# EAGLE design diffamp (EAGLE 9.4.2)
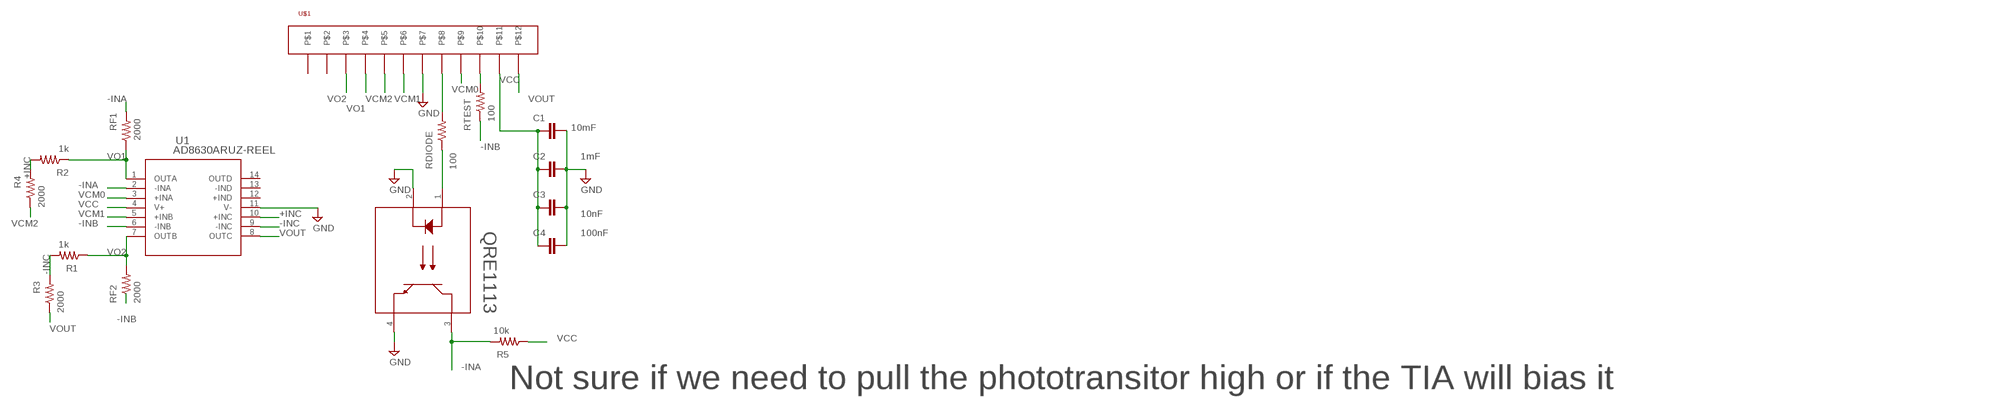
[diagram p0: schematic, sheet 1]

## Parts
C1  10mF  CAP0402-CAP  [0402-CAP]
C2  1mF  CAP0402-CAP  [0402-CAP]
C3  10nF  CAP0402-CAP  [0402-CAP]
C4  100nF  CAP0402-CAP  [0402-CAP]
Q1  QRE1113  [DIP4_100AQ_ONS]
R1  1k  R-US_R0603  [R0603]
R2  1k  R-US_R0603  [R0603]
R3  2000  R-US_R0603  [R0603]
R4  2000  R-US_R0603  [R0603]
R5  10k  R-US_R0603  [R0603]
RDIODE  100  R-US_R0603  [R0603]
RF1  2000  R-US_R0603  [R0603]
RF2  2000  R-US_R0603  [R0603]
RTEST  100  R-US_R0603  [R0603]
U1  AD8630ARUZ-REEL  [RU_14_ADI]
U$1  12PIN  [12PIN]

## Nets
+INC: R2.2 R4.2 U1.10(+INC)
-INA: Q1.3 R5.2 RF1.2 U1.2(-INA)
-INB: RF2.1 RTEST.1 U1.6(-INB)
-INC: R1.2 R3.2 U1.9(-INC)
GND: C1.2 C2.2 C3.2 C4.2 Q1.2 Q1.4 U1.11(V-) U$1.P$7
N$1: RDIODE.2 U$1.P$8
N$3: Q1.1 RDIODE.1
N$4: RTEST.2 U$1.P$10
VCC: C1.1 C2.1 C3.1 C4.1 R5.1 U1.4(V+) U$1.P$11
VCM0: U1.3(+INA) U$1.P$9
VCM1: U1.5(+INB) U$1.P$6
VCM2: R4.1 U$1.P$5
VO1: R2.1 RF1.1 U1.1(OUTA) U$1.P$4
VO2: R1.1 RF2.2 U1.7(OUTB) U$1.P$3
VOUT: R3.1 U1.8(OUTC) U$1.P$12
Unconnected: U1.12(+IND) U1.13(-IND) U1.14(OUTD) U$1.P$1 U$1.P$2

## Notes on the sheet
- Not sure if we need to pull the phototransitor high or if the TIA will bias it

## Library data of the parts
C1-C4 = pie:CAP: Capacitor Standard 0603 ceramic capacitor, and 0.1" leaded capacitor.; PIE-INT-REF-NUM: CAPACITOR-GENERIC
Q1 = pie:QRE1113; BUILT_BY: EMA_Cory; COPYRIGHT: Copyright (C) 2018 Accelerated Designs. All rights reserved; DATASHEET: https://www.onsemi.com/pub/Collateral/QRE1113-D.PDF; MANUFACTURER_PART_NUMBER: QRE1113; SOURCELIBRARY: ON_Semiconudctor_2020-04-15; VENDOR: ON Semiconductor
R1-R5 RDIODE RF1 RF2 RTEST = pie:R-US_: RESISTOR, American symbol; DESCRIPTION: RESISTOR, American symbol; DISTRIBUTOR: DigiKey; MANUFACTURER: Rohm Semiconductor; NOTES: Cut Tape; PACKAGE: R0603; VALUE: >VALUE
U1 = pie:AD8630ARUZ-REEL; BUILT_BY: EMA_Christopher; COPYRIGHT: Copyright (C) 2016 Accelerated Designs. All rights reserved; MANUFACTURER_PART_NUMBER: AD8630ARUZ-REEL; SOURCELIBRARY: Analog_Devices_2018-07-13; VENDOR: Analog Devices Inc
U$1 = pie:12PIN

## Board
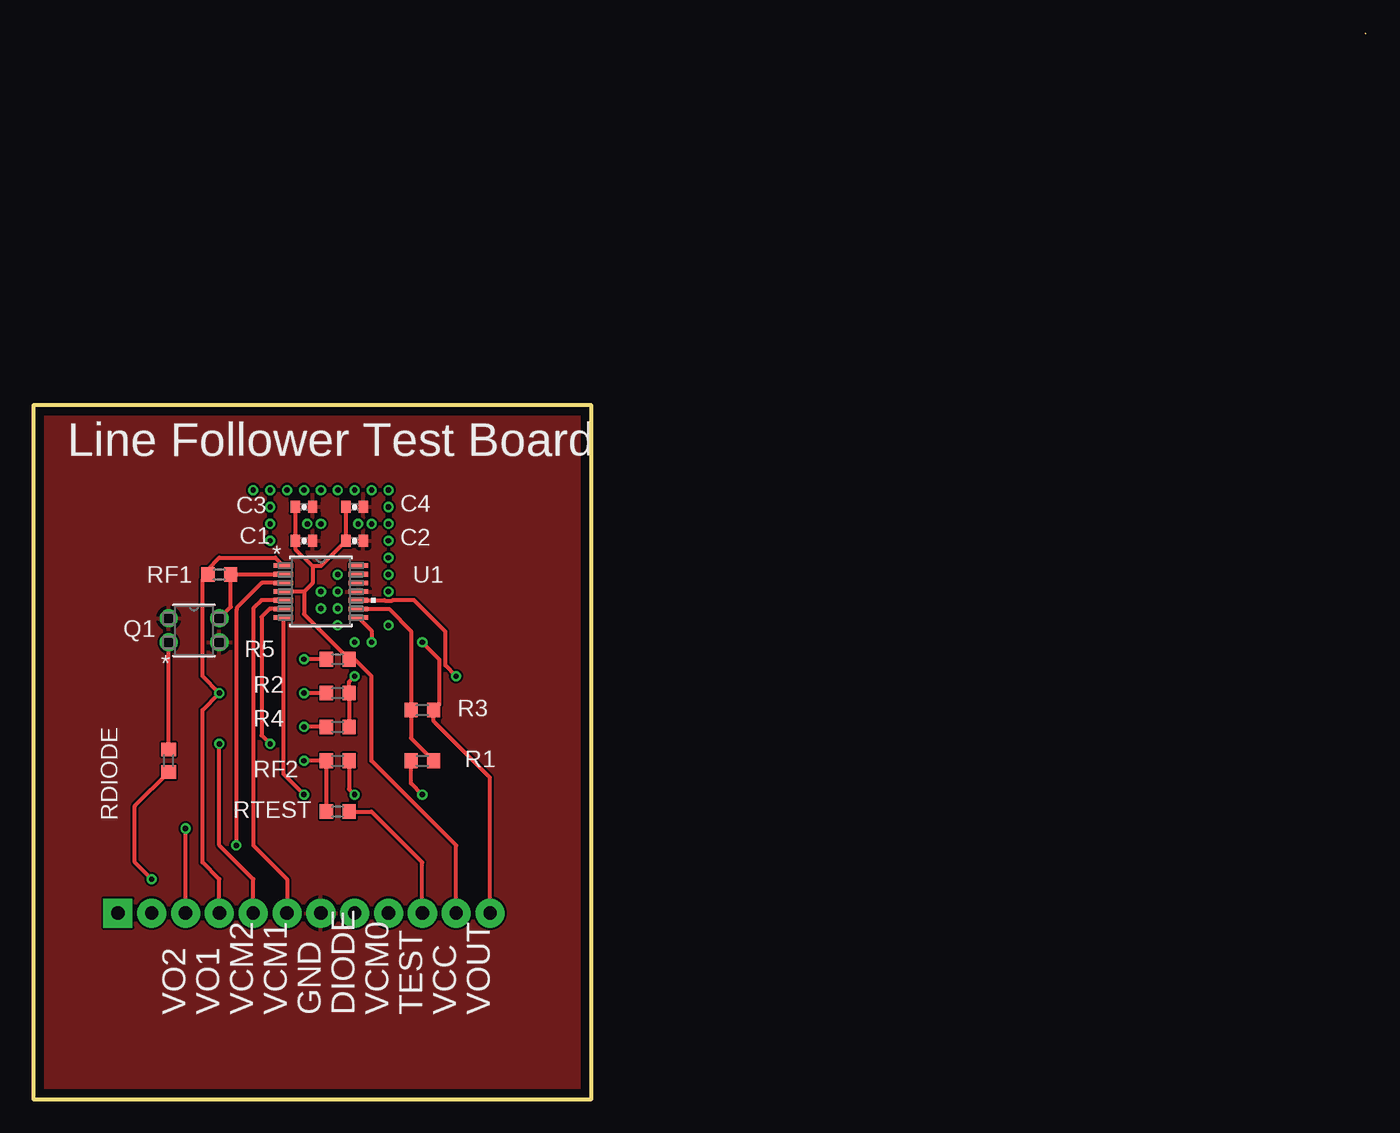
[diagram p1: board, top side]
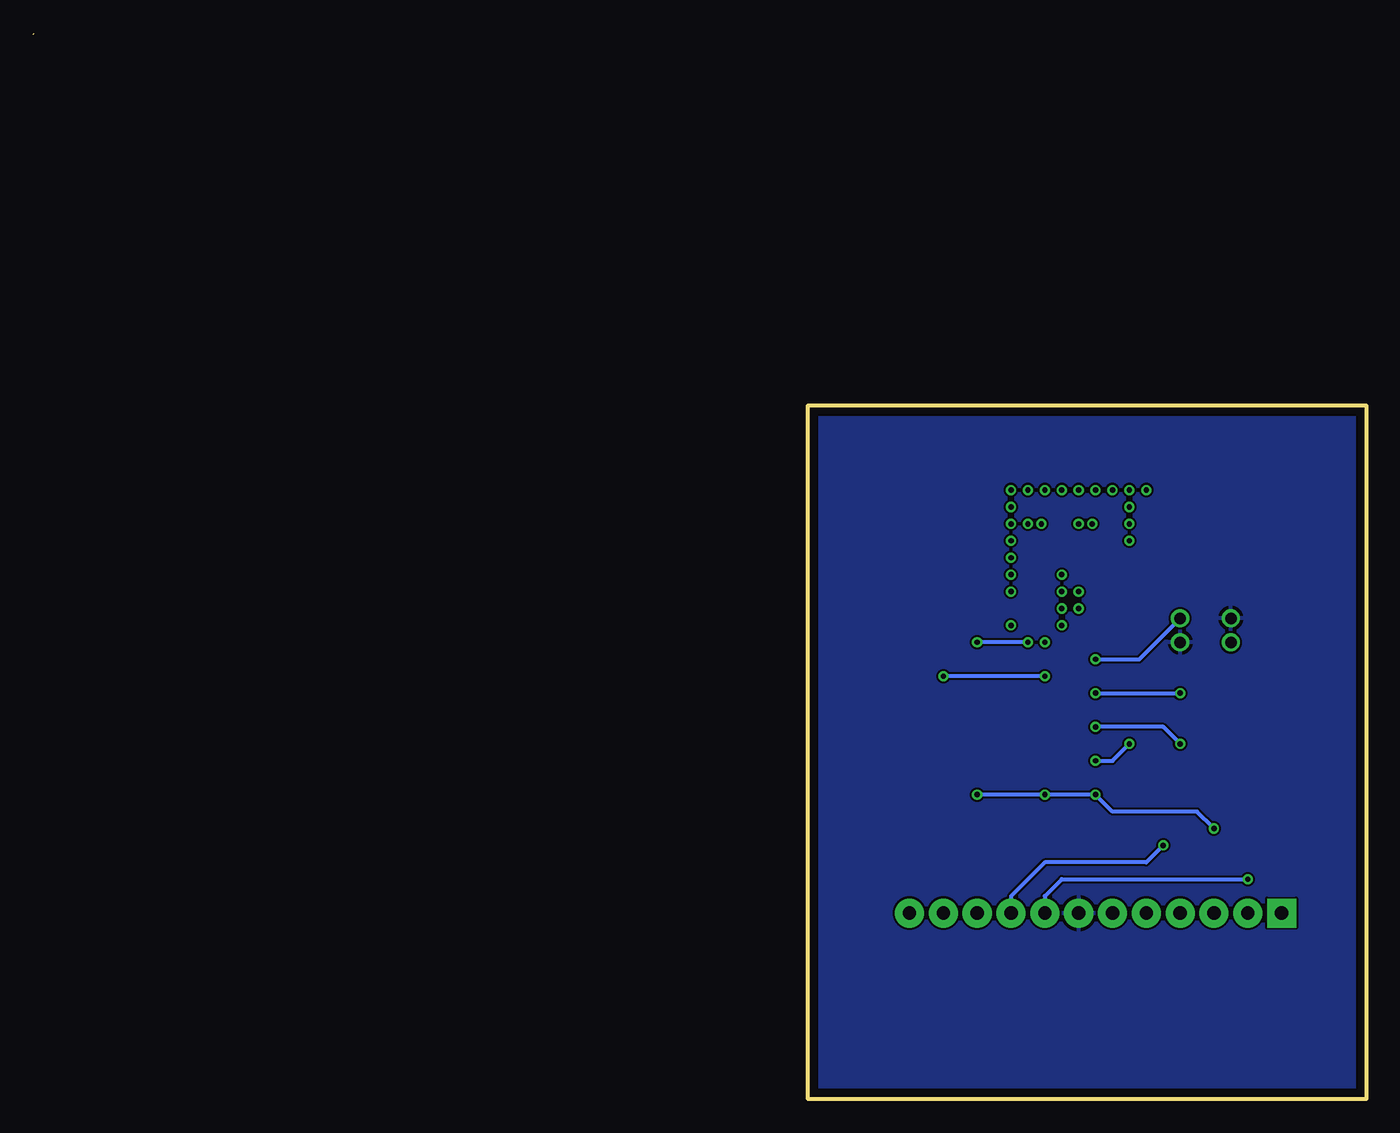
[diagram p2: board, bottom side, seen from below]

Size 100.08 x 80 mm. Coordinates in mm from the lower left corner, seen from the top.
Outline: 100.08,79.92 100,80
Outline: 0,0 41.91,0 41.91,52.07 0,52.07 0,0
Copper layers (1*16): Top 2mil / dielectric 9mil / Bottom 2mil
Design rules "pie": minimum track width 6mil, minimum drill 15mil, track to track 6mil, track to pad 6mil, pad to pad 6mil, via to via 6mil, smd to smd 6mil, copper to edge 25mil, drill to drill 7mil, minimum pad ring 7mil, minimum via ring 7mil, stop-mask expansion 3mil, vias tented up to drill 21mil, thermal gap 10mil

### Footprints (pad centres in the part's own frame; a part is rotated, then mirrored left to right if it is on the bottom)
0402-CAP = smd 0.7 x 0.9: 1 -0.65,0; 2 0.65,0
DIP4_100AQ_ONS = drill 0.864 pad 1.372: 1 0,0; 2 3.81,0; 3 3.81,1.803; 4 0,1.803
R0603 = smd 1 x 1.1: 1 -0.85,0; 2 0.85,0
RU_14_ADI = smd 1.461 x 0.351: 1 -2.825,1.95; 2 -2.825,1.3; 3 -2.825,0.65; 4 -2.825,0; 5 -2.825,-0.65; 6 -2.825,-1.3; 7 -2.825,-1.95; 8 2.825,-1.95; 9 2.825,-1.3; 10 2.825,-0.65; 11 2.825,0; 12 2.825,0.65; 13 2.825,1.3; 14 2.825,1.95
12PIN = drill 1 pad 2.184 square: P$1 0,0 | drill 1 pad 2.184: P$2 2.54,0; P$3 5.08,0; P$4 7.62,0; P$5 10.16,0; P$6 12.7,0; P$7 15.24,0; P$8 17.78,0; P$9 20.32,0; P$10 22.86,0; P$11 25.4,0; P$12 27.94,0

### Placement (x,y rotation side)
C1  20.32,41.91 0 top
C2  24.13,41.91 0 top
C3  20.32,44.45 0 top
C4  24.13,44.45 0 top
Q1  10.16,34.29 0 top
R1  29.21,25.4 0 top
R2  22.86,30.48 0 top
R3  29.21,29.21 180 top
R4  22.86,27.94 0 top
R5  22.86,33.02 180 top
RDIODE  10.16,25.4 270 top
RF1  13.97,39.37 0 top
RF2  22.86,25.4 0 top
RTEST  22.86,21.59 0 top
U1  21.59,38.1 0 top
U$1  6.35,13.97 0 top

### Tracks (layer width: path | path; a pad name or v marks a point on that pad's centre or on a via)
+INC  (via drill 0.38)
  Top 0.305: R4.2 R2.2 23.71,31.33 v24.13,31.75 | U1.10 26.36,37.45 26.39,37.42 26.95,37.42 26.98,37.45 28.59,37.45 30.94,35.1 30.94,32.56 v31.75,31.75
  Bottom 0.305: v24.13,31.75 v31.75,31.75
-INA  (via drill 0.4)
  Top 0.305: U1.2 14.85,39.4 RF1.2 14.82,36.94 Q1.3 | R5.2 v20.32,33.02
  Bottom 0.305: v20.32,33.02 17.04,33.02 Q1.3
-INB  (via drill 0.4)
  Top 0.305: U1.6 17.81,36.8 17.78,36.83 17.14,36.2 17.14,27.3 v17.78,26.67 | v20.32,25.4 RF2.1 RTEST.1
  Bottom 0.305: v20.32,25.4 19.05,25.4 v17.78,26.67
-INC
  Top 0.305: U1.9 26.7,36.8 28.36,35.14 R3.2 28.36,27.1 R1.2
GND
  pour Top: 0,52.07 41.91,52.07 41.91,0 0,0
  pour Bottom: 41.91,53.09 41.91,-1.27 0,-1.27 0,52.04
N$1  (via drill 0.4)
  Top 0.305: v8.89,16.51 7.62,17.78 7.62,22.01 RDIODE.2
  Bottom 0.305: v8.89,16.51 22.86,16.51 24.13,15.24 U$1.P$8
N$2  (via drill 0.4)
  other vias: 22.86,38.1
N$3
  Top 0.305: RDIODE.1 Q1.1
N$4
  Top 0.305: U$1.P$10 29.21,17.78 25.4,21.59 RTEST.2
N$5  (via drill 0.4)
  other vias: 26.67,38.1
N$6  (via drill 0.4)
  other vias: 26.67,39.37
N$7  (via drill 0.4)
  other vias: 25.4,45.72
N$8  (via drill 0.4)
  other vias: 26.67,44.45
N$9  (via drill 0.4)
  other vias: 26.67,41.91
N$10  (via drill 0.4)
  other vias: 26.67,43.18
N$11  (via drill 0.4)
  other vias: 24.13,45.72
N$12  (via drill 0.4)
  other vias: 21.59,45.72
N$13  (via drill 0.4)
  other vias: 20.32,45.72
N$14  (via drill 0.4)
  other vias: 19.05,45.72
N$15  (via drill 0.4)
  other vias: 17.78,44.45
N$16  (via drill 0.4)
  other vias: 17.78,43.18
N$17  (via drill 0.4)
  other vias: 17.78,41.91
N$18  (via drill 0.4)
  other vias: 22.86,39.37
N$19  (via drill 0.4)
  other vias: 22.86,36.83
N$20  (via drill 0.4)
  other vias: 24.13,34.29
N$21  (via drill 0.4)
  other vias: 26.67,35.56
N$22  (via drill 0.4)
  other vias: 21.59,43.18
N$23  (via drill 0.4)
  other vias: 25.4,43.18
N$24  (via drill 0.4)
  other vias: 26.67,40.64
N$25  (via drill 0.4)
  other vias: 17.78,45.72
N$26  (via drill 0.4)
  other vias: 22.86,45.72
N$27  (via drill 0.4)
  other vias: 26.67,45.72
N$28  (via drill 0.4)
  other vias: 20.57,43.18
N$29  (via drill 0.4)
  other vias: 24.38,43.18
N$30  (via drill 0.4)
  other vias: 21.59,38.1
N$31  (via drill 0.4)
  other vias: 21.59,36.83
N$32  (via drill 0.4)
  other vias: 16.51,45.72
N$33  (via drill 0.4)
  other vias: 22.86,35.56
VCC
  Top 0.305: 20.32,38.1 20.95,38.73 20.95,40.01 | 20.32,38.1 U1.4 | C3.1 C1.1 19.67,41.29 20.95,40.01 | 20.95,40.01 21.57,40.01 C2.1 C4.1 | 20.32,38.1 20.32,36.41 R5.1 24.13,33.02 25.4,31.75 25.4,25.4 31.75,19.05 U$1.P$11
VCM0  (via drill 0.4)
  Top 0.305: U1.3 17.16,38.75 15.28,36.87 15.28,36.75 15.24,36.72 v15.24,19.05
  Bottom 0.305: v15.24,19.05 16.51,17.78 24.13,17.78 26.67,15.24 U$1.P$9
VCM1
  Top 0.305: U1.5 17.13,37.45 16.51,36.83 16.51,19.05 19.05,16.51 U$1.P$6
VCM2  (via drill 0.4)
  Top 0.305: R4.1 v20.32,27.94 | U$1.P$5 16.51,16.51 13.97,19.05 v13.97,26.67
  Bottom 0.305: v13.97,26.67 15.24,27.94 v20.32,27.94
VO1  (via drill 0.4)
  Top 0.305: U1.1 18.18,40.64 13.97,40.64 13.12,39.79 RF1.1 12.7,38.95 12.7,31.75 v13.97,30.48 12.7,29.21 12.7,17.78 13.97,16.51 U$1.P$4 | R2.1 v20.32,30.48
  Bottom 0.305: v20.32,30.48 v13.97,30.48
VO2  (via drill 0.4)
  Top 0.305: U$1.P$3 v11.43,20.32 | v20.32,22.86 18.77,24.41 U1.7 | v29.21,22.86 28.36,23.71 R1.1 | RF2.2 23.71,23.28 v24.13,22.86
  Bottom 0.305: v11.43,20.32 12.7,21.59 19.05,21.59 v20.32,22.86 v24.13,22.86 v29.21,22.86
VOUT  (via drill 0.4)
  Top 0.305: U1.8 25.4,35.16 v25.4,34.29 | v29.21,34.29 30.48,33.02 30.48,29.63 R3.1 30.06,28.36 34.29,24.13 U$1.P$12
  Bottom 0.305: v25.4,34.29 v29.21,34.29

### Text on the board
tNames: Line Follower Test Board | VO2 | VO1 | VCM2 | VCM1 | GND | DIODE | VCM0 | TEST | VCC | VOUT